# Altium schematic sheet SOC Display, HDMI, EDP.SchDoc: RK3399 SOM Module
size A4; Date: 23.05.2023; Author: Łukasz Nowarkiewicz; SheetNumber: 8; SheetTotal: 21; RegistrationBookNumber: 144201; title_sheet: SOC Display, HDMI, EDP
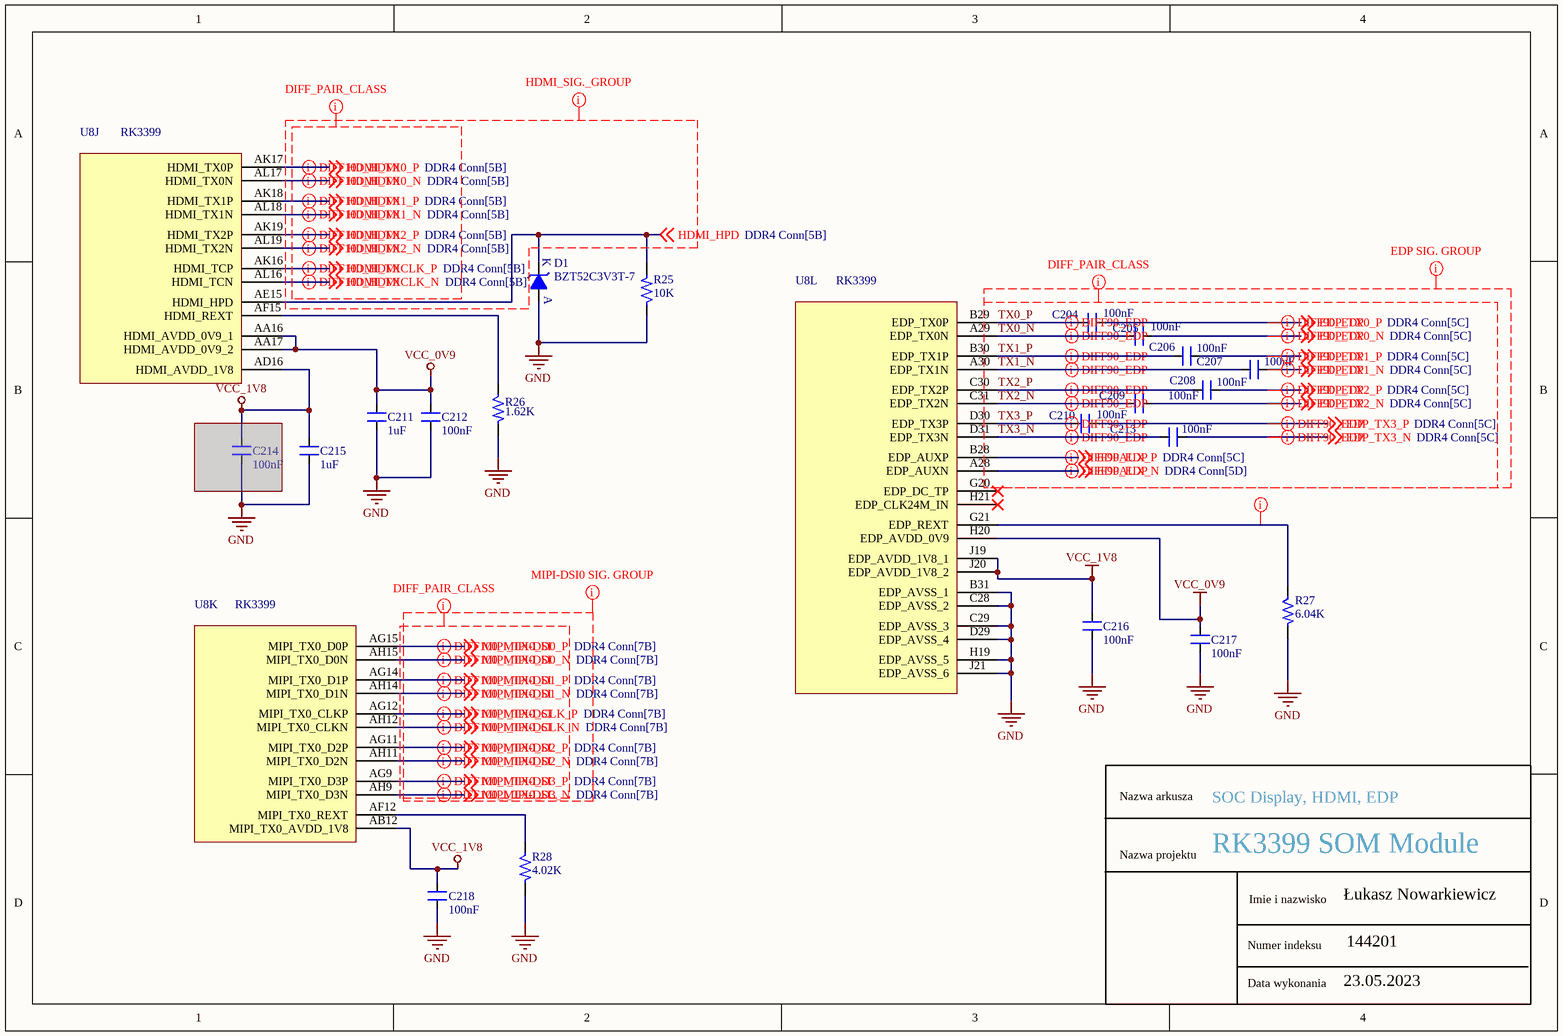
[diagram p0: SOC Display, HDMI, EDP.SchDoc]

## Parts
C204  100nF  [CAP_0201]
C205  100nF  [CAP_0201]
C206  100nF  [CAP_0201]
C207  100nF  [CAP_0201]
C208  100nF  [CAP_0201]
C209  100nF  [CAP_0201]
C210  100nF  [CAP_0201]
C211  1uF  [CAP_0201]
C212  100nF  [CAP_0201]
C213  100nF  [CAP_0201]
C214  100nF  [CAP_0201]  (masked out: inside a compile mask, not in the netlist)
C215  1uF  [CAP_0201]
C216  100nF  [CAP_0201]
C217  100nF  [CAP_0201]
C218  100nF  [CAP_0201]
D1  BZT52C3V3T-7  [DIO_SOD523]
R25  10K  [RES_0201]
R26  1.62K  [RES_0201]
R27  6.04K  [RES_0201]
R28  4.02K  [RES_0201]
U8  RK3399  [FBGA828_23_826X826]  (parts J,K,L of 24)

## Nets
GND: C211.1 C212.1 C215.1 C216.2 C217.1 C218.1 D1.A R25.1 R26.2 R27.2 R28.2 U8.B31(EDP_AVSS_1) U8.C28(EDP_AVSS_2) U8.C29(EDP_AVSS_3) U8.D29(EDP_AVSS_4) U8.H19(EDP_AVSS_5) U8.J21(EDP_AVSS_6)
VCC_0V9: C211.2 C212.2 C217.2 U8.AA16(HDMI_AVDD_0V9_1) U8.AA17(HDMI_AVDD_0V9_2) U8.H20(EDP_AVDD_0V9)
VCC_1V8: C215.2 C216.1 C218.2 U8.AB12(MIPI_TX0_AVDD_1V8) U8.AD16(HDMI_AVDD_1V8) U8.J19(EDP_AVDD_1V8_1) U8.J20(EDP_AVDD_1V8_2)
EDP_TX0_N: C205.1 ; off-sheet EDP_TX0_N
EDP_TX0_P: C204.1 ; off-sheet EDP_TX0_P
EDP_TX1_N: C207.1 ; off-sheet EDP_TX1_N
EDP_TX1_P: C206.1 ; off-sheet EDP_TX1_P
EDP_TX2_N: C209.1 ; off-sheet EDP_TX2_N
EDP_TX2_P: C208.1 ; off-sheet EDP_TX2_P
EDP_TX3_N: C213.1 ; off-sheet EDP_TX3_N
EDP_TX3_P: C210.1 ; off-sheet EDP_TX3_P
EDPAUX_N: U8.A28(EDP_AUXN) ; off-sheet EDPAUX_N
EDPAUX_P: U8.B28(EDP_AUXP) ; off-sheet EDPAUX_P
HDMI_HPD: D1.K R25.2 U8.AE15(HDMI_HPD) ; off-sheet HDMI_HPD
HDMI_TX0_N: U8.AL17(HDMI_TX0N) ; off-sheet HDMI_TX0_N
HDMI_TX0_P: U8.AK17(HDMI_TX0P) ; off-sheet HDMI_TX0_P
HDMI_TX1_N: U8.AL18(HDMI_TX1N) ; off-sheet HDMI_TX1_N
HDMI_TX1_P: U8.AK18(HDMI_TX1P) ; off-sheet HDMI_TX1_P
HDMI_TX2_N: U8.AL19(HDMI_TX2N) ; off-sheet HDMI_TX2_N
HDMI_TX2_P: U8.AK19(HDMI_TX2P) ; off-sheet HDMI_TX2_P
HDMI_TXCLK_N: U8.AL16(HDMI_TCN) ; off-sheet HDMI_TXCLK_N
HDMI_TXCLK_P: U8.AK16(HDMI_TCP) ; off-sheet HDMI_TXCLK_P
MIPI_TX0_CLK_N: U8.AH12(MIPI_TX0_CLKN) ; off-sheet MIPI_TX0_CLK_N
MIPI_TX0_CLK_P: U8.AG12(MIPI_TX0_CLKP) ; off-sheet MIPI_TX0_CLK_P
MIPI_TX0_D0_N: U8.AH15(MIPI_TX0_D0N) ; off-sheet MIPI_TX0_D0_N
MIPI_TX0_D0_P: U8.AG15(MIPI_TX0_D0P) ; off-sheet MIPI_TX0_D0_P
MIPI_TX0_D1_N: U8.AH14(MIPI_TX0_D1N) ; off-sheet MIPI_TX0_D1_N
MIPI_TX0_D1_P: U8.AG14(MIPI_TX0_D1P) ; off-sheet MIPI_TX0_D1_P
MIPI_TX0_D2_N: U8.AH11(MIPI_TX0_D2N) ; off-sheet MIPI_TX0_D2_N
MIPI_TX0_D2_P: U8.AG11(MIPI_TX0_D2P) ; off-sheet MIPI_TX0_D2_P
MIPI_TX0_D3_N: U8.AH9(MIPI_TX0_D3N) ; off-sheet MIPI_TX0_D3_N
MIPI_TX0_D3_P: U8.AG9(MIPI_TX0_D3P) ; off-sheet MIPI_TX0_D3_P
TX0_N: C205.2 U8.A29(EDP_TX0N)
TX0_P: C204.2 U8.B29(EDP_TX0P)
TX1_N: C207.2 U8.A30(EDP_TX1N)
TX1_P: C206.2 U8.B30(EDP_TX1P)
TX2_N: C209.2 U8.C31(EDP_TX2N)
TX2_P: C208.2 U8.C30(EDP_TX2P)
TX3_N: C213.2 U8.D31(EDP_TX3N)
TX3_P: C210.2 U8.D30(EDP_TX3P)
NetR26_1: R26.1 U8.AF15(HDMI_REXT)
NetR27_1: R27.1 U8.G21(EDP_REXT)
NetR28_1: R28.1 U8.AF12(MIPI_TX0_REXT)

Not connected (* = marked no-connect by the designer): U8 G20(EDP_DC_TP)* H21(EDP_CLK24M_IN)*

## Layout directives
net class EDP_GROUP: NetR27_1
CompClassName: DIFF_PAIR_CLASS: EDP_TX0_N, EDP_TX0_P, EDP_TX1_N, EDP_TX1_P, EDP_TX2_N, EDP_TX2_P, EDP_TX3_N, EDP_TX3_P, EDPAUX_N, EDPAUX_P, HDMI_TX0_N, HDMI_TX0_P, HDMI_TX1_N, HDMI_TX1_P, HDMI_TX2_N, HDMI_TX2_P, HDMI_TXCLK_N, HDMI_TXCLK_P, MIPI_TX0_CLK_N, MIPI_TX0_CLK_P, MIPI_TX0_D0_N, MIPI_TX0_D0_P, MIPI_TX0_D1_N, MIPI_TX0_D1_P, MIPI_TX0_D2_N, MIPI_TX0_D2_P, MIPI_TX0_D3_N, MIPI_TX0_D3_P, TX0_N, TX0_P, TX1_N, TX1_P, TX2_N, TX2_P, TX3_N, TX3_P
CompClassName: HDMI_SIG._GROUP: HDMI_HPD, HDMI_TX0_N, HDMI_TX0_P, HDMI_TX1_N, HDMI_TX1_P, HDMI_TX2_N, HDMI_TX2_P, HDMI_TXCLK_N, HDMI_TXCLK_P
differential pair; differential pair class DIFF100_HDMI: HDMI_TX0_N, HDMI_TX0_P, HDMI_TX1_N, HDMI_TX1_P, HDMI_TX2_N, HDMI_TX2_P, HDMI_TXCLK_N, HDMI_TXCLK_P
differential pair; differential pair class DIFF100_MIPI-DSI; differential pair class DIFF100_MIPI-DSI: MIPI_TX0_D0_P
differential pair; differential pair class DIFF100_MIPI-DSI: MIPI_TX0_CLK_N, MIPI_TX0_CLK_P, MIPI_TX0_D0_N, MIPI_TX0_D1_N, MIPI_TX0_D1_P, MIPI_TX0_D2_N, MIPI_TX0_D2_P, MIPI_TX0_D3_N, MIPI_TX0_D3_P
differential pair; differential pair class DIFF90_EDP: EDP_TX0_N, EDP_TX0_P, EDP_TX1_N, EDP_TX1_P, EDP_TX2_N, EDP_TX2_P, EDP_TX3_N, EDP_TX3_P, EDPAUX_N, EDPAUX_P, TX0_N, TX0_P, TX1_N, TX1_P, TX2_N, TX2_P, TX3_N, TX3_P
CompClassName: MIPI-DSI0 SIG. GROUP: MIPI_TX0_CLK_N, MIPI_TX0_CLK_P, MIPI_TX0_D0_N, MIPI_TX0_D0_P, MIPI_TX0_D1_N, MIPI_TX0_D1_P, MIPI_TX0_D2_N, MIPI_TX0_D2_P, MIPI_TX0_D3_N, MIPI_TX0_D3_P
CompClassName: EDP SIG. GROUP: EDP_TX0_N, EDP_TX0_P, EDP_TX1_N, EDP_TX1_P, EDP_TX2_N, EDP_TX2_P, EDP_TX3_N, EDP_TX3_P, EDPAUX_N, EDPAUX_P, TX0_N, TX0_P, TX1_N, TX1_P, TX2_N, TX2_P, TX3_N, TX3_P

## Notes on the sheet
- Nazwa arkusza
- Nazwa projektu
- Imie i nazwisko
- Data wykonania
- Numer indeksu

## Library data of the parts
C204-C210 C212-C214 C216-C218 = CAP_100nF-25V-10%-0201: 0.1µF ±10% 25V Ceramic Capacitor X5R 0201 (0603 Metric); Manufacturer: TDK Corporation; Manufacturer Part Number: C0603X5R1E104K030BB; Case/Package: 0201; Supplier-1: Digikey
C211 C215 = CAP_1uF-16V-10%-0201: 1µF ±20% 16V Ceramic Capacitor X5R 0201 (0603 Metric); Manufacturer: Samsung Electro-Mechanics; Manufacturer Part Number: CL03A105MO3NRNH; Case/Package: 0201; Supplier-1: Digikey
D1 = DIO-Z_3.3V-300mW-SOD-523: Zener Diode 3.3V 300mW ±6% Surface Mount SOD-523; Manufacturer: Diodes Incorporated; Manufacturer Part Number: BZT52C3V3T-7; Case/Package: SOD523; Supplier-1: Digikey
R25 = RES_10K-0.05W-1%-0201: 10 kOhms ±1% 0.05W, 1/20W Chip Resistor 0201 (0603 Metric) Thick Film; Manufacturer: Stackpole Electronics Inc; Manufacturer Part Number: RMCF0201FT10K0; Case/Package: 0201; Supplier-1: Digikey
R26 = RES_1.62K-0.05W-1%-0201: 1.62 kOhms ±1% 0.05W, 1/20W Chip Resistor 0201 (0603 Metric) Automotive AEC-Q200 Thick Film; Manufacturer: Panasonic Electronic Components; Manufacturer Part Number: ERJ-1GNF1621C; Case/Package: 0201; Supplier-1: Digikey
R27 = RES_6.04K-0.05W-1%-0201: 6.04 kOhms ±1% 0.05W, 1/20W Chip Resistor 0201 (0603 Metric) Thick Film; Manufacturer: Panasonic Electronic Components; Manufacturer Part Number: ERJ-1GEF6041C; Case/Package: 0201; Supplier-1: Digikey
R28 = RES_4.02K-0.05W-1%-0201: 4.02 kOhms ±1% 0.05W, 1/20W Chip Resistor 0201 (0603 Metric) Thick Film; Manufacturer: Yageo; Manufacturer Part Number: RC0201FR-074K02L; Case/Package: 0201; Supplier-1: Digikey
U8 = IC_RK3399-FCBGA828: RK3399 is a low power, high performance processor for computing, personal mobile.; Manufacturer: Rockchip; Manufacturer Part Number: RK3399; Case/Package: FCBGA828; Supplier-1: Rockchip